# Altium schematic sheet RGB三维.SchDoc
size A3
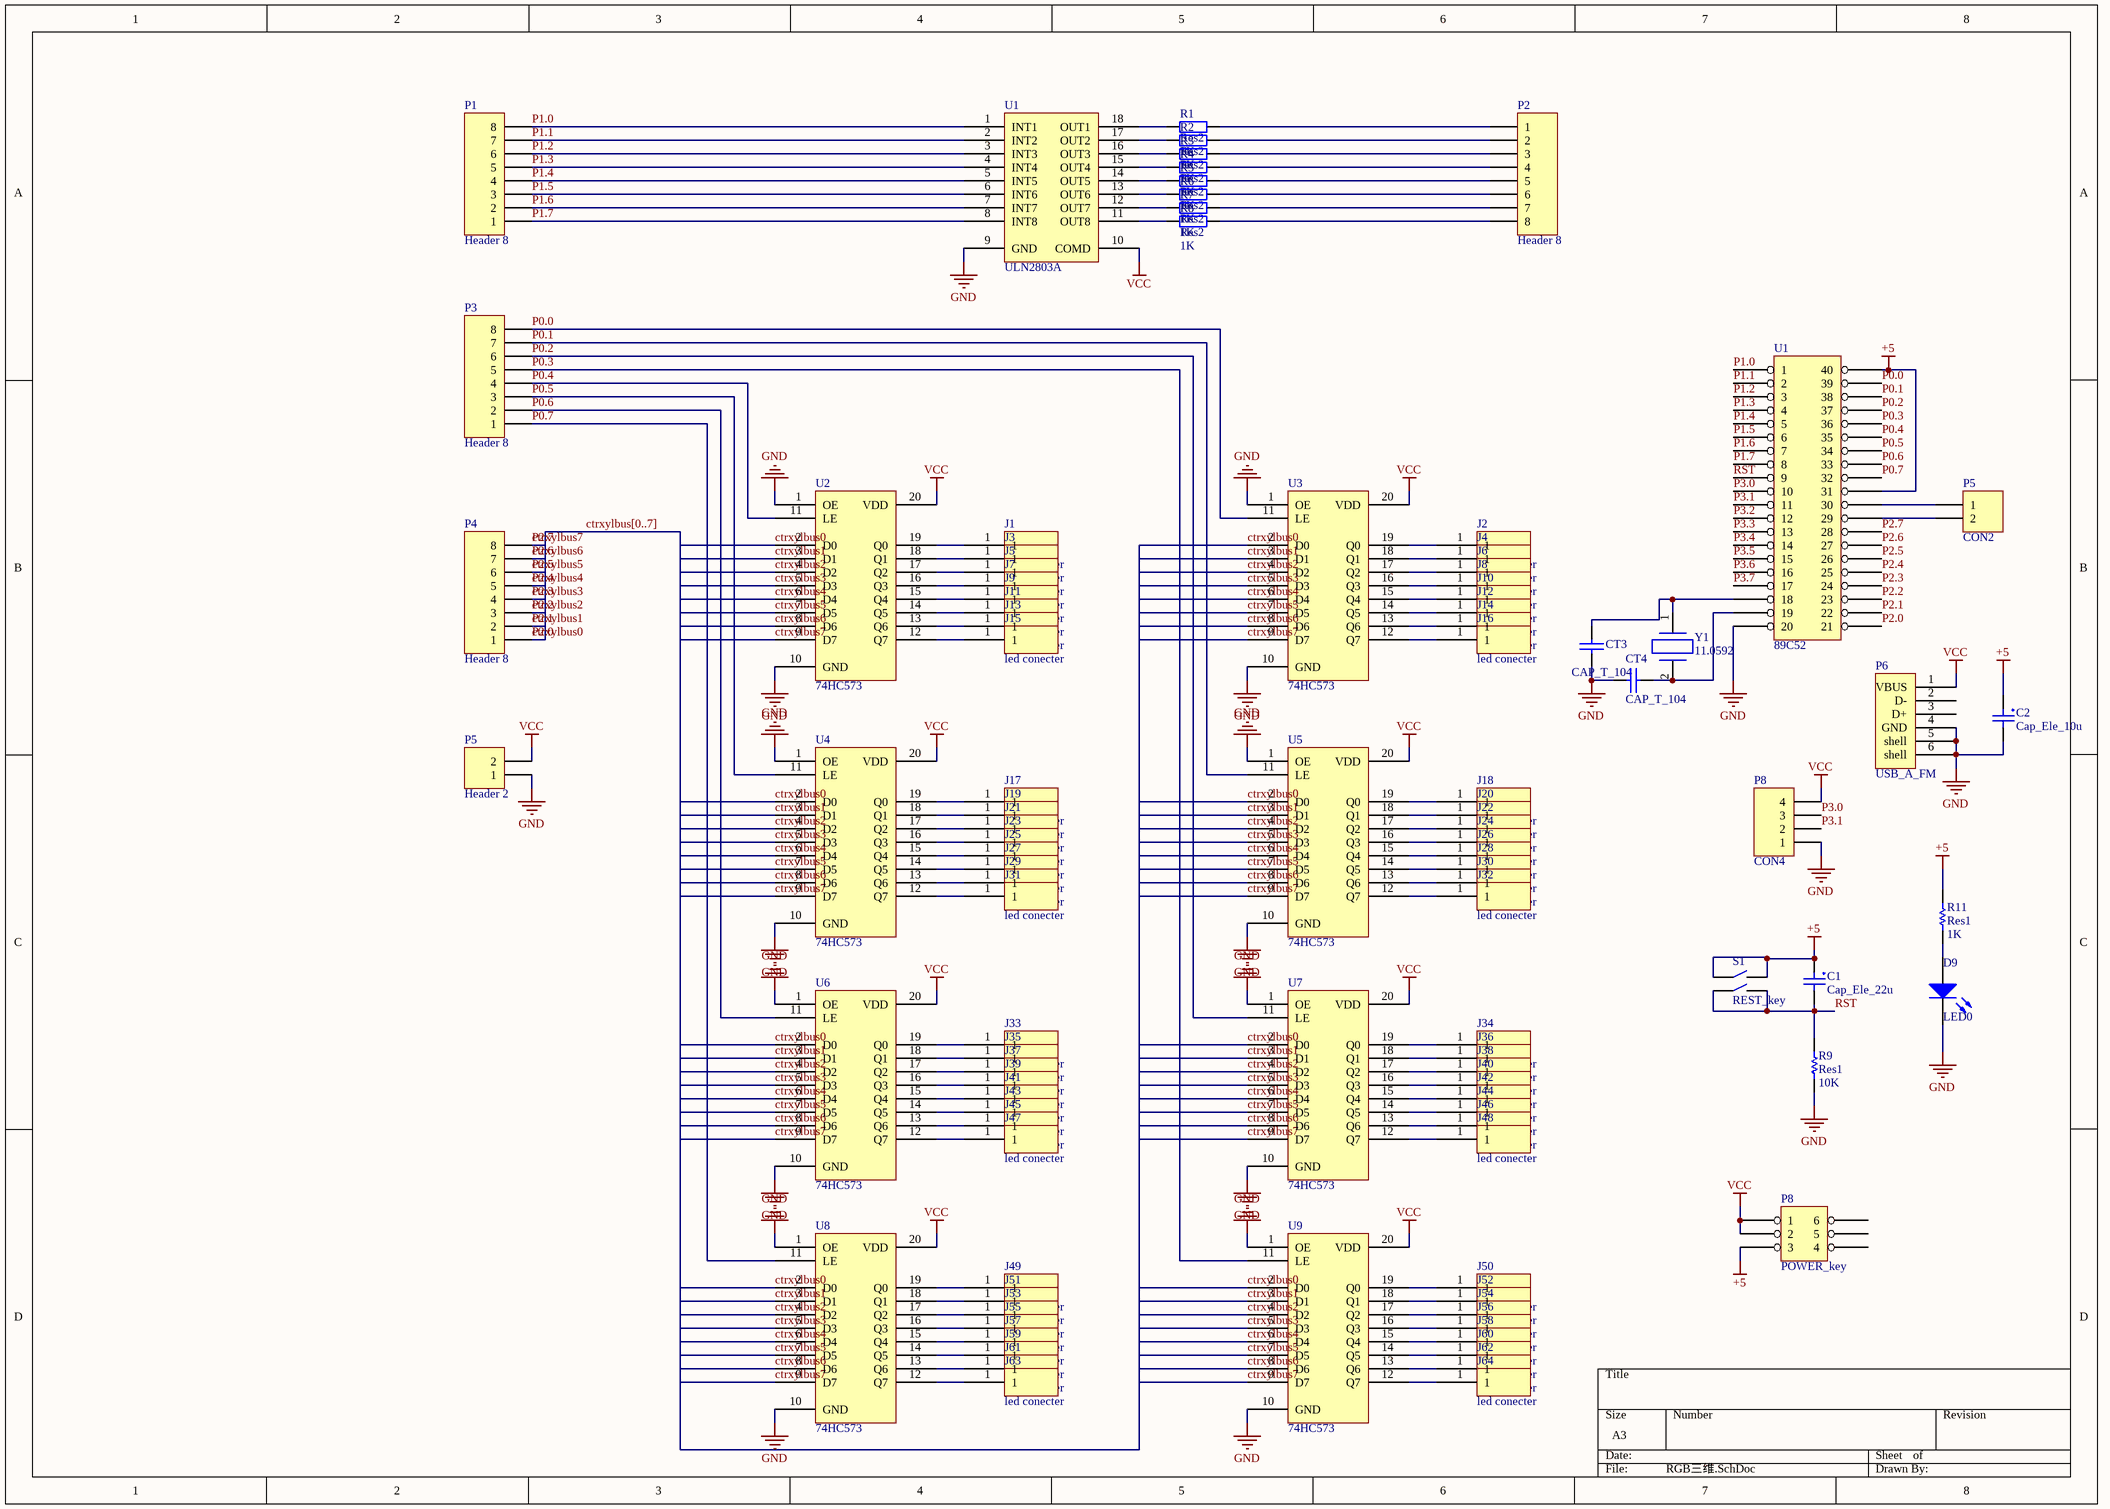
[diagram p0: RGB三维.SchDoc]

## Parts
(Parts that share a designator on the sheet are numbered #1, #2 ... from top to bottom, then left to right.)
C1  Cap_Ele_22u  [Cap_Ele_22u]
C2  Cap_Ele_10u  [Cap_Ele_22u]
CT3  CAP_T_104  [RC_T]
CT4  CAP_T_104  [RC_T]
D9  LED0  [LED]
J1  led conecter  [led conecter]
J2  led conecter  [led conecter]
J3  led conecter  [led conecter]
J4  led conecter  [led conecter]
J5  led conecter  [led conecter]
J6  led conecter  [led conecter]
J7  led conecter  [led conecter]
J8  led conecter  [led conecter]
J9  led conecter  [led conecter]
J10  led conecter  [led conecter]
J11  led conecter  [led conecter]
J12  led conecter  [led conecter]
J13  led conecter  [led conecter]
J14  led conecter  [led conecter]
J15  led conecter  [led conecter]
J16  led conecter  [led conecter]
J17  led conecter  [led conecter]
J18  led conecter  [led conecter]
J19  led conecter  [led conecter]
J20  led conecter  [led conecter]
J21  led conecter  [led conecter]
J22  led conecter  [led conecter]
J23  led conecter  [led conecter]
J24  led conecter  [led conecter]
J25  led conecter  [led conecter]
J26  led conecter  [led conecter]
J27  led conecter  [led conecter]
J28  led conecter  [led conecter]
J29  led conecter  [led conecter]
J30  led conecter  [led conecter]
J31  led conecter  [led conecter]
J32  led conecter  [led conecter]
J33  led conecter  [led conecter]
J34  led conecter  [led conecter]
J35  led conecter  [led conecter]
J36  led conecter  [led conecter]
J37  led conecter  [led conecter]
J38  led conecter  [led conecter]
J39  led conecter  [led conecter]
J40  led conecter  [led conecter]
J41  led conecter  [led conecter]
J42  led conecter  [led conecter]
J43  led conecter  [led conecter]
J44  led conecter  [led conecter]
J45  led conecter  [led conecter]
J46  led conecter  [led conecter]
J47  led conecter  [led conecter]
J48  led conecter  [led conecter]
J49  led conecter  [led conecter]
J50  led conecter  [led conecter]
J51  led conecter  [led conecter]
J52  led conecter  [led conecter]
J53  led conecter  [led conecter]
J54  led conecter  [led conecter]
J55  led conecter  [led conecter]
J56  led conecter  [led conecter]
J57  led conecter  [led conecter]
J58  led conecter  [led conecter]
J59  led conecter  [led conecter]
J60  led conecter  [led conecter]
J61  led conecter  [led conecter]
J62  led conecter  [led conecter]
J63  led conecter  [led conecter]
J64  led conecter  [led conecter]
P1  Header 8  [HDR1X8]
P2  Header 8  [HDR1X8]
P3  Header 8  [HDR1X8]
P4  Header 8  [HDR1X8]
P5#1  CON2  [HDR1X2]
P5#2  Header 2  [HDR1X2]
P6  USB_A_FM  [USB_A_FM]
P8#1  CON4  [HDR1X4]
P8#2  POWER_key  [POWER_key]
R1  Res2  value 1K  [AXIAL-0.4]
R2  Res2  value 1K  [AXIAL-0.4]
R3  Res2  value 1K  [AXIAL-0.4]
R4  Res2  value 1K  [AXIAL-0.4]
R5  Res2  value 1K  [AXIAL-0.4]
R6  Res2  value 1K  [AXIAL-0.4]
R7  Res2  value 1K  [AXIAL-0.4]
R8  Res2  value 1K  [AXIAL-0.4]
R9  Res1  value 10K  [AXIAL-0.3]
R11  Res1  value 1K  [AXIAL-0.3]
S1  REST_key  [REST_key]
U1#1  ULN2803A  [ULN2803A]
U1#2  89C52  [89C52]
U2  74HC573  [74HC573]
U3  74HC573  [74HC573]
U4  74HC573  [74HC573]
U5  74HC573  [74HC573]
U6  74HC573  [74HC573]
U7  74HC573  [74HC573]
U8  74HC573  [74HC573]
U9  74HC573  [74HC573]
Y1  11.0592  [11.0592]

## Nets
+5: C1.1 C2.1 P8#2.3 R11.2 S1.1 S1.2 U1#2.31 U1#2.40
GND: C2.2 CT3.2 CT4.1 D9.2(K) P5#2.1 P6.4(GND) P6.5(shell) P6.6(shell) P8#1.1 R9.1 U1#1.9(GND) U1#2.20 U2.1(OE) U2.10(GND) U3.1(OE) U3.10(GND) U4.1(OE) U4.10(GND) U5.1(OE) U5.10(GND) U6.1(OE) U6.10(GND) U7.1(OE) U7.10(GND) U8.1(OE) U8.10(GND) U9.1(OE) U9.10(GND)
VCC: P5#2.2 P6.1(VBUS) P8#1.4 P8#2.1 P8#2.2 U1#1.10(COMD) U2.20(VDD) U3.20(VDD) U4.20(VDD) U5.20(VDD) U6.20(VDD) U7.20(VDD) U8.20(VDD) U9.20(VDD)
ctrxylbus0: P4.1 U1#2.21 U2.2(D0) U3.2(D0) U4.2(D0) U5.2(D0) U6.2(D0) U7.2(D0) U8.2(D0) U9.2(D0)  [also labelled P2.0]
ctrxylbus1: P4.2 U1#2.22 U2.3(D1) U3.3(D1) U4.3(D1) U5.3(D1) U6.3(D1) U7.3(D1) U8.3(D1) U9.3(D1)  [also labelled P2.1]
ctrxylbus2: P4.3 U1#2.23 U2.4(D2) U3.4(D2) U4.4(D2) U5.4(D2) U6.4(D2) U7.4(D2) U8.4(D2) U9.4(D2)  [also labelled P2.2]
ctrxylbus3: P4.4 U1#2.24 U2.5(D3) U3.5(D3) U4.5(D3) U5.5(D3) U6.5(D3) U7.5(D3) U8.5(D3) U9.5(D3)  [also labelled P2.3]
ctrxylbus4: P4.5 U1#2.25 U2.6(D4) U3.6(D4) U4.6(D4) U5.6(D4) U6.6(D4) U7.6(D4) U8.6(D4) U9.6(D4)  [also labelled P2.4]
ctrxylbus5: P4.6 U1#2.26 U2.7(D5) U3.7(D5) U4.7(D5) U5.7(D5) U6.7(D5) U7.7(D5) U8.7(D5) U9.7(D5)  [also labelled P2.5]
ctrxylbus6: P4.7 U1#2.27 U2.8(D6) U3.8(D6) U4.8(D6) U5.8(D6) U6.8(D6) U7.8(D6) U8.8(D6) U9.8(D6)  [also labelled P2.6]
ctrxylbus7: P4.8 U1#2.28 U2.9(D7) U3.9(D7) U4.9(D7) U5.9(D7) U6.9(D7) U7.9(D7) U8.9(D7) U9.9(D7)  [also labelled P2.7]
P0.0: P3.8 U1#2.39 U3.11(LE)
P0.1: P3.7 U1#2.38 U5.11(LE)
P0.2: P3.6 U1#2.37 U7.11(LE)
P0.3: P3.5 U1#2.36 U9.11(LE)
P0.4: P3.4 U1#2.35 U2.11(LE)
P0.5: P3.3 U1#2.34 U4.11(LE)
P0.6: P3.2 U1#2.33 U6.11(LE)
P0.7: P3.1 U1#2.32 U8.11(LE)
P1.0: P1.8 U1#1.1(INT1) U1#2.1
P1.1: P1.7 U1#1.2(INT2) U1#2.2
P1.2: P1.6 U1#1.3(INT3) U1#2.3
P1.3: P1.5 U1#1.4(INT4) U1#2.4
P1.4: P1.4 U1#1.5(INT5) U1#2.5
P1.5: P1.3 U1#1.6(INT6) U1#2.6
P1.6: P1.2 U1#1.7(INT7) U1#2.7
P1.7: P1.1 U1#1.8(INT8) U1#2.8
P3.0: P8#1.3 U1#2.10
P3.1: P8#1.2 U1#2.11
P3.2: U1#2.12
P3.3: U1#2.13
P3.4: U1#2.14
P3.5: U1#2.15
P3.6: U1#2.16
P3.7: U1#2.17
RST: C1.2 R9.2 S1.3 S1.4 U1#2.9
NetCT3_1: CT3.1 U1#2.18 Y1.1
NetCT4_2: CT4.2 U1#2.19 Y1.2
NetD9_1: D9.1(A) R11.1
NetJ1_1: J1.1 U2.19(Q0)
NetJ2_1: J2.1 U3.19(Q0)
NetJ3_1: J3.1 U2.18(Q1)
NetJ4_1: J4.1 U3.18(Q1)
NetJ5_1: J5.1 U2.17(Q2)
NetJ6_1: J6.1 U3.17(Q2)
NetJ7_1: J7.1 U2.16(Q3)
NetJ8_1: J8.1 U3.16(Q3)
NetJ9_1: J9.1 U2.15(Q4)
NetJ10_1: J10.1 U3.15(Q4)
NetJ11_1: J11.1 U2.14(Q5)
NetJ12_1: J12.1 U3.14(Q5)
NetJ13_1: J13.1 U2.13(Q6)
NetJ14_1: J14.1 U3.13(Q6)
NetJ15_1: J15.1 U2.12(Q7)
NetJ16_1: J16.1 U3.12(Q7)
NetJ17_1: J17.1 U4.19(Q0)
NetJ18_1: J18.1 U5.19(Q0)
NetJ19_1: J19.1 U4.18(Q1)
NetJ20_1: J20.1 U5.18(Q1)
NetJ21_1: J21.1 U4.17(Q2)
NetJ22_1: J22.1 U5.17(Q2)
NetJ23_1: J23.1 U4.16(Q3)
NetJ24_1: J24.1 U5.16(Q3)
NetJ25_1: J25.1 U4.15(Q4)
NetJ26_1: J26.1 U5.15(Q4)
NetJ27_1: J27.1 U4.14(Q5)
NetJ28_1: J28.1 U5.14(Q5)
NetJ29_1: J29.1 U4.13(Q6)
NetJ30_1: J30.1 U5.13(Q6)
NetJ31_1: J31.1 U4.12(Q7)
NetJ32_1: J32.1 U5.12(Q7)
NetJ33_1: J33.1 U6.19(Q0)
NetJ34_1: J34.1 U7.19(Q0)
NetJ35_1: J35.1 U6.18(Q1)
NetJ36_1: J36.1 U7.18(Q1)
NetJ37_1: J37.1 U6.17(Q2)
NetJ38_1: J38.1 U7.17(Q2)
NetJ39_1: J39.1 U6.16(Q3)
NetJ40_1: J40.1 U7.16(Q3)
NetJ41_1: J41.1 U6.15(Q4)
NetJ42_1: J42.1 U7.15(Q4)
NetJ43_1: J43.1 U6.14(Q5)
NetJ44_1: J44.1 U7.14(Q5)
NetJ45_1: J45.1 U6.13(Q6)
NetJ46_1: J46.1 U7.13(Q6)
NetJ47_1: J47.1 U6.12(Q7)
NetJ48_1: J48.1 U7.12(Q7)
NetJ49_1: J49.1 U8.19(Q0)
NetJ50_1: J50.1 U9.19(Q0)
NetJ51_1: J51.1 U8.18(Q1)
NetJ52_1: J52.1 U9.18(Q1)
NetJ53_1: J53.1 U8.17(Q2)
NetJ54_1: J54.1 U9.17(Q2)
NetJ55_1: J55.1 U8.16(Q3)
NetJ56_1: J56.1 U9.16(Q3)
NetJ57_1: J57.1 U8.15(Q4)
NetJ58_1: J58.1 U9.15(Q4)
NetJ59_1: J59.1 U8.14(Q5)
NetJ60_1: J60.1 U9.14(Q5)
NetJ61_1: J61.1 U8.13(Q6)
NetJ62_1: J62.1 U9.13(Q6)
NetJ63_1: J63.1 U8.12(Q7)
NetJ64_1: J64.1 U9.12(Q7)
NetP2_1: P2.1 R1.2
NetP2_2: P2.2 R2.2
NetP2_3: P2.3 R3.2
NetP2_4: P2.4 R4.2
NetP2_5: P2.5 R5.2
NetP2_6: P2.6 R6.2
NetP2_7: P2.7 R7.2
NetP2_8: P2.8 R8.2
NetP5#1_1: P5#1.1 U1#2.30
NetP5#1_2: P5#1.2 U1#2.29
NetR1_1: R1.1 U1#1.18(OUT1)
NetR2_1: R2.1 U1#1.17(OUT2)
NetR3_1: R3.1 U1#1.16(OUT3)
NetR4_1: R4.1 U1#1.15(OUT4)
NetR5_1: R5.1 U1#1.14(OUT5)
NetR6_1: R6.1 U1#1.13(OUT6)
NetR7_1: R7.1 U1#1.12(OUT7)
NetR8_1: R8.1 U1#1.11(OUT8)

Not connected (* = marked no-connect by the designer): P6 2(D-) 3(D+); P8#2 4 5 6

## Buses and harness runs
bus ctrxylbus[0..7]

## Library data of the parts
C2 = Cap_Ele_22u
CT3 CT4 = CAP_T
D9 = LED0: Typical INFRARED GaAs LED; Published: 8-Jun-2000; LatestRevisionDate: 08-Jul-2005; LatestRevisionNote: Mech Layer 1 removed.; PackageReference: LED-0; Publisher: Altium Limited; PackageDescription: LED; 2 Leads
P1-P4 = Header 8: Header, 8-Pin; LatestRevisionDate: 17-Jul-2002; LatestRevisionNote: Re-released for DXP Platform.; Publisher: Altium Limited
P5#1 P5#2 = Header 2: Header, 2-Pin; LatestRevisionDate: 17-Jul-2002; LatestRevisionNote: Re-released for DXP Platform.; Publisher: Altium Limited
P8#1 = Header 4: Header, 4-Pin; LatestRevisionDate: 17-Jul-2002; LatestRevisionNote: Re-released for DXP Platform.; Publisher: Altium Limited
R1-R8 = Res2: Resistor; Published: 8-Jun-2000; LatestRevisionDate: 17-Jul-2002; LatestRevisionNote: Re-released for DXP Platform.; PackageReference: AXIAL-0.4; Publisher: Altium Limited
R9 R11 = Res1: Resistor; Published: 8-Jun-2000; LatestRevisionDate: 17-Jul-2002; LatestRevisionNote: Re-released for DXP Platform.; PackageReference: AXIAL-0.3; Publisher: Altium Limited; PackageDescription: Axial Device, Thru-Hole; 2 Leads; 0.3 in Pin Spacing